# Altium schematic sheet Boot.SchDoc
size A3; Author: ALP Electronics; CompanyName: ALP Electronics; DrawnBy: Caner Alp; Engineer: Caner Alp; Organization: ALP Electronics; Address2: Västerås; Address4: Sweden; SheetNumber: 10; SheetTotal: 10
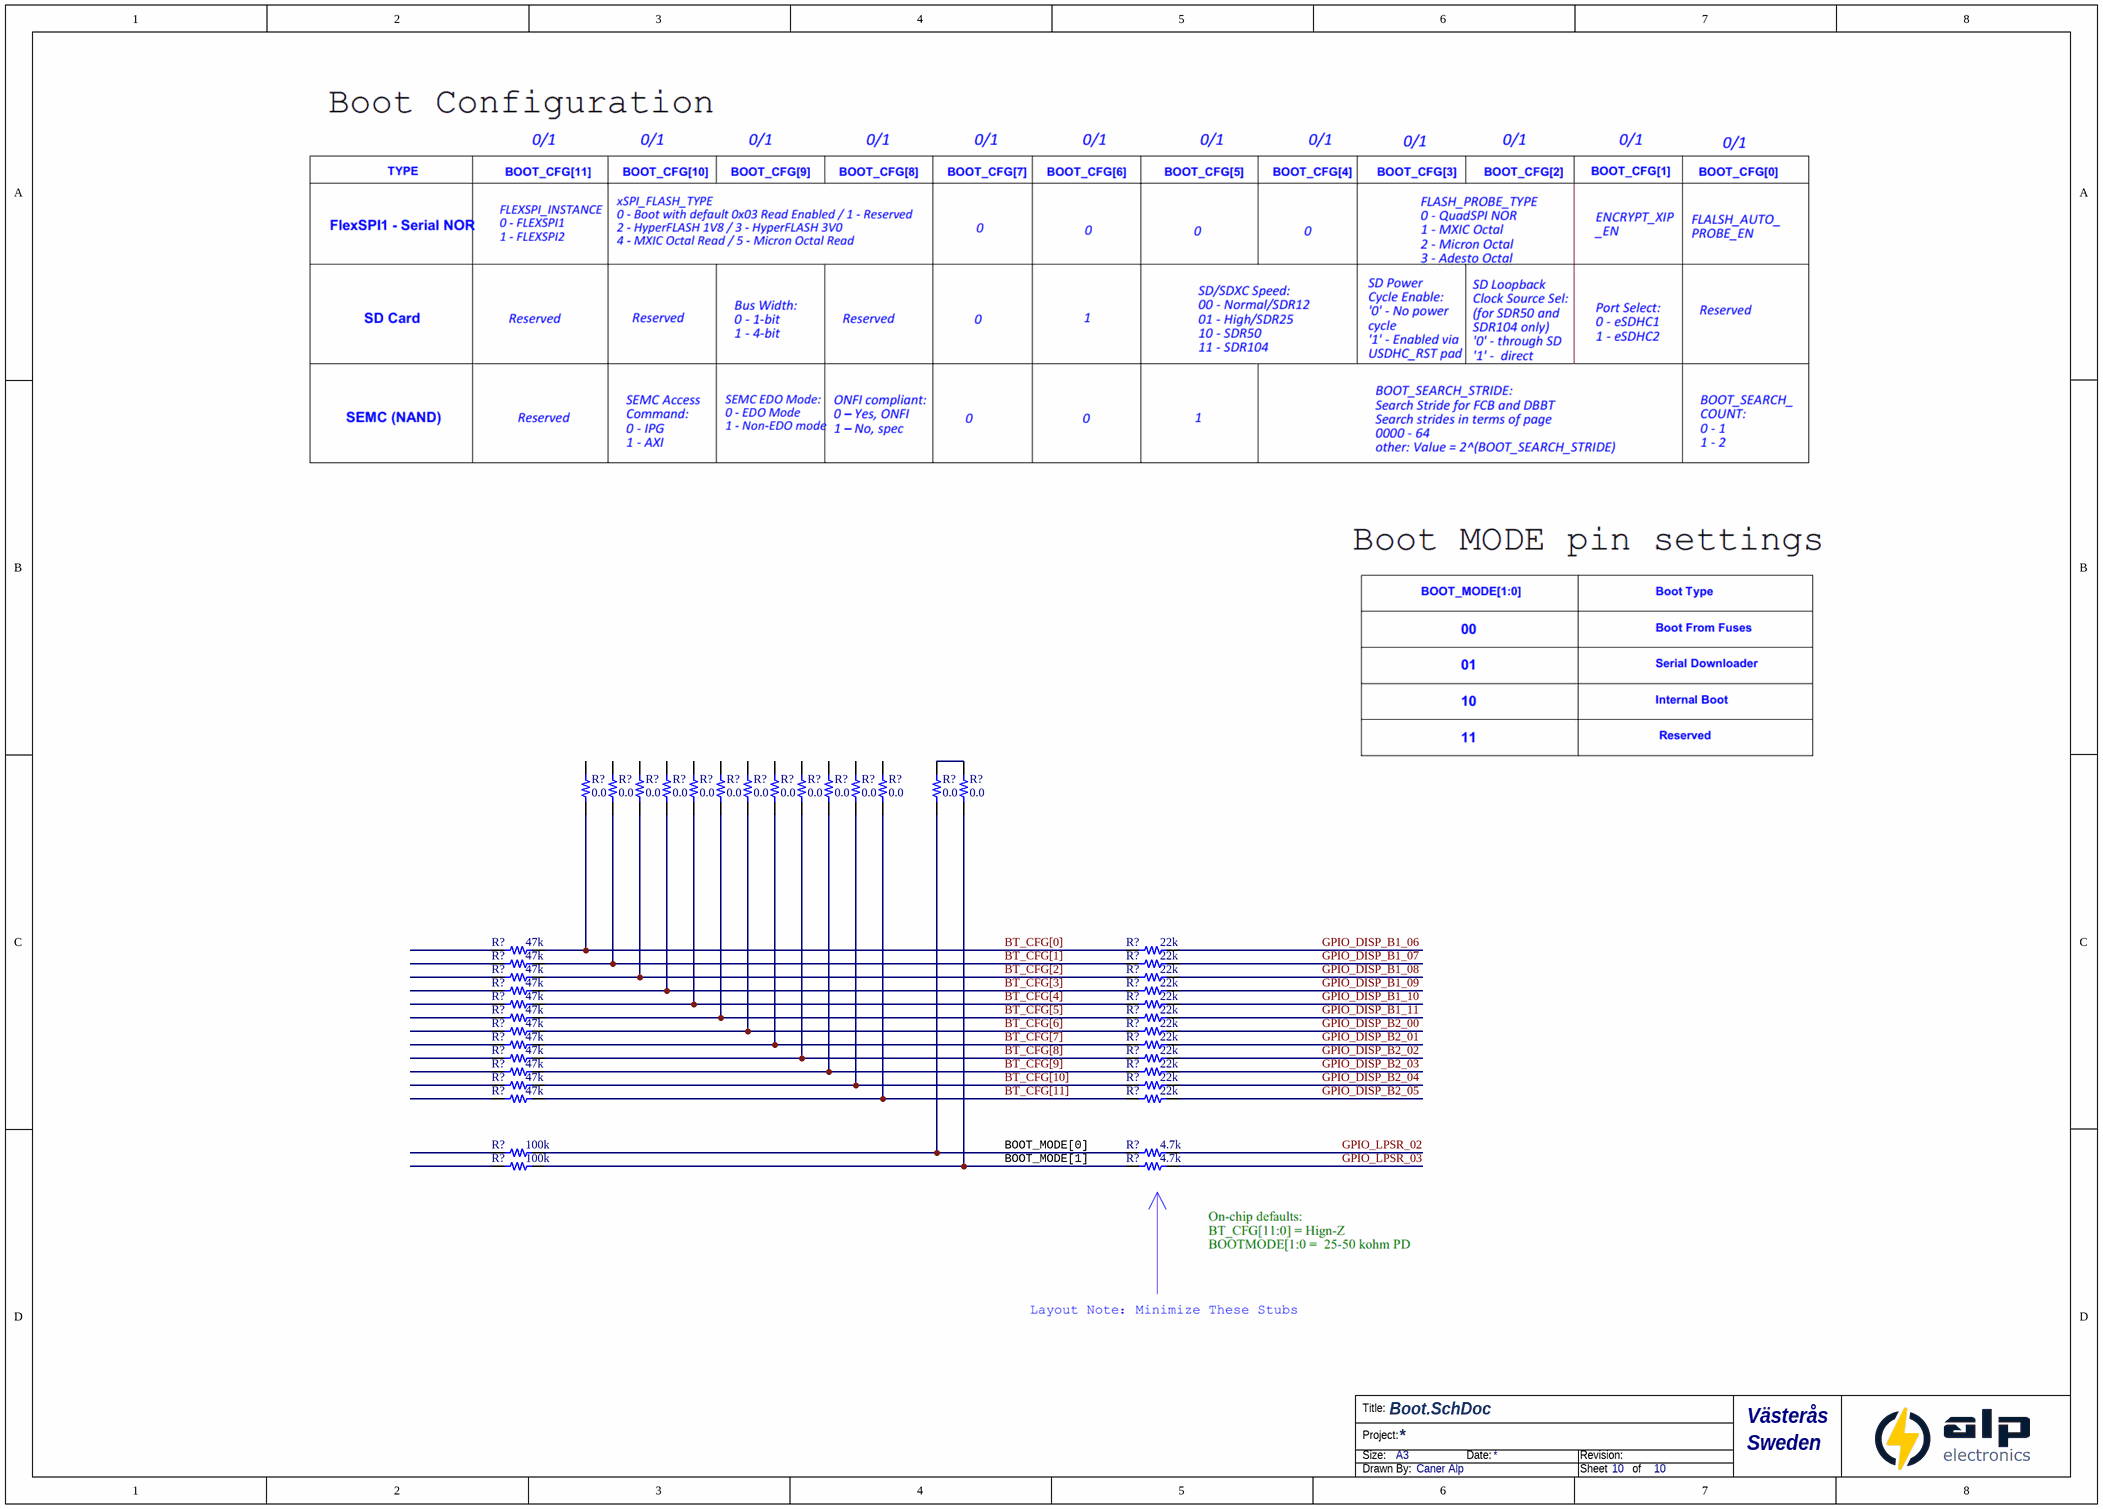
[diagram p0: Boot.SchDoc]

## Parts
(Parts that share a designator on the sheet are numbered #1, #2 ... from top to bottom, then left to right.)
R?#1  0.0  [RES 0402/1005]
R?#2  0.0  [RES 0402/1005]
R?#3  0.0  [RES 0402/1005]
R?#4  0.0  [RES 0402/1005]
R?#5  0.0  [RES 0402/1005]
R?#6  0.0  [RES 0402/1005]
R?#7  0.0  [RES 0402/1005]
R?#8  0.0  [RES 0402/1005]
R?#9  0.0  [RES 0402/1005]
R?#10  0.0  [RES 0402/1005]
R?#11  0.0  [RES 0402/1005]
R?#12  0.0  [RES 0402/1005]
R?#13  0.0  [RES 0402/1005]
R?#14  0.0  [RES 0402/1005]
R?#15  47k  [RES 0402/1005]
R?#16  22k  [RES 0402/1005]
R?#17  47k  [RES 0402/1005]
R?#18  22k  [RES 0402/1005]
R?#19  47k  [RES 0402/1005]
R?#20  22k  [RES 0402/1005]
R?#21  47k  [RES 0402/1005]
R?#22  22k  [RES 0402/1005]
R?#23  47k  [RES 0402/1005]
R?#24  22k  [RES 0402/1005]
R?#25  47k  [RES 0402/1005]
R?#26  22k  [RES 0402/1005]
R?#27  47k  [RES 0402/1005]
R?#28  22k  [RES 0402/1005]
R?#29  47k  [RES 0402/1005]
R?#30  22k  [RES 0402/1005]
R?#31  47k  [RES 0402/1005]
R?#32  22k  [RES 0402/1005]
R?#33  47k  [RES 0402/1005]
R?#34  22k  [RES 0402/1005]
R?#35  47k  [RES 0402/1005]
R?#36  22k  [RES 0402/1005]
R?#37  47k  [RES 0402/1005]
R?#38  22k  [RES 0402/1005]
R?#39  100k  [RES 0402/1005]
R?#40  4.7k  [RES 0402/1005]
R?#41  100k  [RES 0402/1005]
R?#42  4.7k  [RES 0402/1005]

## Nets
BT_CFG[0]: R?#1.1 R?#15.2 R?#16.1
BT_CFG[1]: R?#2.1 R?#17.2 R?#18.1
BT_CFG[2]: R?#3.1 R?#19.2 R?#20.1
BT_CFG[3]: R?#4.1 R?#21.2 R?#22.1
BT_CFG[4]: R?#5.1 R?#23.2 R?#24.1
BT_CFG[5]: R?#6.1 R?#25.2 R?#26.1
BT_CFG[6]: R?#7.1 R?#27.2 R?#28.1
BT_CFG[7]: R?#8.1 R?#29.2 R?#30.1
BT_CFG[8]: R?#9.1 R?#31.2 R?#32.1
BT_CFG[9]: R?#10.1 R?#33.2 R?#34.1
BT_CFG[10]: R?#11.1 R?#35.2 R?#36.1
BT_CFG[11]: R?#12.1 R?#37.2 R?#38.1
GPIO_DISP_B1_06: R?#16.2
GPIO_DISP_B1_07: R?#18.2
GPIO_DISP_B1_08: R?#20.2
GPIO_DISP_B1_09: R?#22.2
GPIO_DISP_B1_10: R?#24.2
GPIO_DISP_B1_11: R?#26.2
GPIO_DISP_B2_00: R?#28.2
GPIO_DISP_B2_01: R?#30.2
GPIO_DISP_B2_02: R?#32.2
GPIO_DISP_B2_03: R?#34.2
GPIO_DISP_B2_04: R?#36.2
GPIO_DISP_B2_05: R?#38.2
GPIO_LPSR_02: R?#40.2
GPIO_LPSR_03: R?#42.2
NetR?#13_1: R?#13.1 R?#39.2 R?#40.1
NetR?#13_2: R?#13.2 R?#14.2
NetR?#14_1: R?#14.1 R?#41.2 R?#42.1

Not connected (* = marked no-connect by the designer): R?#1 2; R?#2 2; R?#3 2; R?#4 2; R?#5 2; R?#6 2; R?#7 2; R?#8 2; R?#9 2; R?#10 2; R?#11 2; R?#12 2; R?#15 1; R?#17 1; R?#19 1; R?#21 1; R?#23 1; R?#25 1; R?#27 1; R?#29 1; R?#31 1; R?#33 1; R?#35 1; R?#37 1; R?#39 1; R?#41 1

## Notes on the sheet
- BOOT_MODE[0]
- BOOT_MODE[1]
- Title:
- Size:
- Project:
- A3
- Date:
- Revision:
- Drawn By:
- Sheet
- of

## Library data of the parts
R?#1-R?#14 = RC0402JR-070RL: RES SMD 0.0OHM JUMPER 1/16W 0402; Manufacturer: Yageo; TemperatureRange: -55C ~ 155C; PowerRating: 0.063W, 1/16W; Value: 0.0; Part Number: RC0402JR-070RL; PartId: 16128; Supplier 1: Digi-Key; Supplier Part Number 1: 311-0.0JRTR-ND; ComponentLink1Description: Datasheet; ComponentLink1URL: http://www.yageo.com/documents/recent/PYu-RC_Group_51_RoHS_L_04.pdf; ComponentLink2Description: Digi-Key Listing; ComponentLink2URL: https://www.digikey.com/product-detail/en/yageo/RC0402JR-070RL/311-0.0JRTR-ND/726406; Tolerance: Jumper; Price: 0,0019; Device Package: 0402 (1005 Metric)
R?#15 R?#17 R?#19 R?#21 R?#23 R?#25 R?#27 R?#29 R?#31 R?#33 R?#35 R?#37 = ERJ-2GEJ473X: RES SMD 47K OHM 5% 1/10W 0402; Manufacturer: Panasonic Electronic Components; TemperatureRange: -55C ~ 155C; TemperatureCoefficient: 200ppm/C; PowerRating: 0.1W, 1/10W; Value: 47k; Part Number: ERJ-2GEJ473X; PartId: 10986; Supplier 1: Digi-Key; Supplier Part Number 1: P47KJTR-ND; ComponentLink1Description: Datasheet; ComponentLink1URL: http://industrial.panasonic.com/www-cgi/jvcr13pz.cgi?E+PZ+3+AOA0001+ERJ2GEJ473X+7+WW; ComponentLink2Description: Digi-Key Listing; ComponentLink2URL: https://www.digikey.com/product-detail/en/panasonic-electronic-components/ERJ-2GEJ473X/P47KJTR-ND/147022; Tolerance: 5%; Price: 0,0019; Device Package: 0402 (1005 Metric)
R?#16 R?#18 R?#20 R?#22 R?#24 R?#26 R?#28 R?#30 R?#32 R?#34 R?#36 R?#38 = ERJ-2GEJ223X: RES SMD 22K OHM 5% 1/10W 0402; Manufacturer: Panasonic Electronic Components; TemperatureRange: -55C ~ 155C; TemperatureCoefficient: 200ppm/C; PowerRating: 0.1W, 1/10W; Value: 22k; Part Number: ERJ-2GEJ223X; PartId: 10994; Supplier 1: Digi-Key; Supplier Part Number 1: P22KJTR-ND; ComponentLink1Description: Datasheet; ComponentLink1URL: http://industrial.panasonic.com/www-cgi/jvcr13pz.cgi?E+PZ+3+AOA0001+ERJ2GEJ223X+7+WW; ComponentLink2Description: Digi-Key Listing; ComponentLink2URL: https://www.digikey.com/product-detail/en/panasonic-electronic-components/ERJ-2GEJ223X/P22KJTR-ND/146940; Tolerance: 5%; Price: 0,0019; Device Package: 0402 (1005 Metric)
R?#39 R?#41 = ERJ-2GEJ104X: RES SMD 100K OHM 5% 1/10W 0402; Manufacturer: Panasonic Electronic Components; TemperatureRange: -55C ~ 155C; TemperatureCoefficient: 200ppm/C; PowerRating: 0.1W, 1/10W; Value: 100k; Part Number: ERJ-2GEJ104X; PartId: 10985; Supplier 1: Digi-Key; Supplier Part Number 1: P100KJTR-ND; ComponentLink1Description: Datasheet; ComponentLink1URL: http://industrial.panasonic.com/www-cgi/jvcr13pz.cgi?E+PZ+3+AOA0001+ERJ2GEJ104X+7+WW; ComponentLink2Description: Digi-Key Listing; ComponentLink2URL: https://www.digikey.com/product-detail/en/panasonic-electronic-components/ERJ-2GEJ104X/P100KJTR-ND/146731; Tolerance: 5%; Price: 0,0019; Device Package: 0402 (1005 Metric)
R?#40 R?#42 = ERJ-2GEJ472X: RES SMD 4.7K OHM 5% 1/10W 0402; Manufacturer: Panasonic Electronic Components; TemperatureRange: -55C ~ 155C; TemperatureCoefficient: 200ppm/C; PowerRating: 0.1W, 1/10W; Value: 4.7k; Part Number: ERJ-2GEJ472X; PartId: 10980; Supplier 1: Digi-Key; Supplier Part Number 1: P4.7KJTR-ND; ComponentLink1Description: Datasheet; ComponentLink1URL: http://industrial.panasonic.com/www-cgi/jvcr13pz.cgi?E+PZ+3+AOA0001+ERJ2GEJ472X+7+WW; ComponentLink2Description: Digi-Key Listing; ComponentLink2URL: https://www.digikey.com/product-detail/en/panasonic-electronic-components/ERJ-2GEJ472X/P4.7KJTR-ND/147026; Tolerance: 5%; Price: 0,0019; Device Package: 0402 (1005 Metric)